# Altium schematic sheet etapa_1.SchDoc
size A4
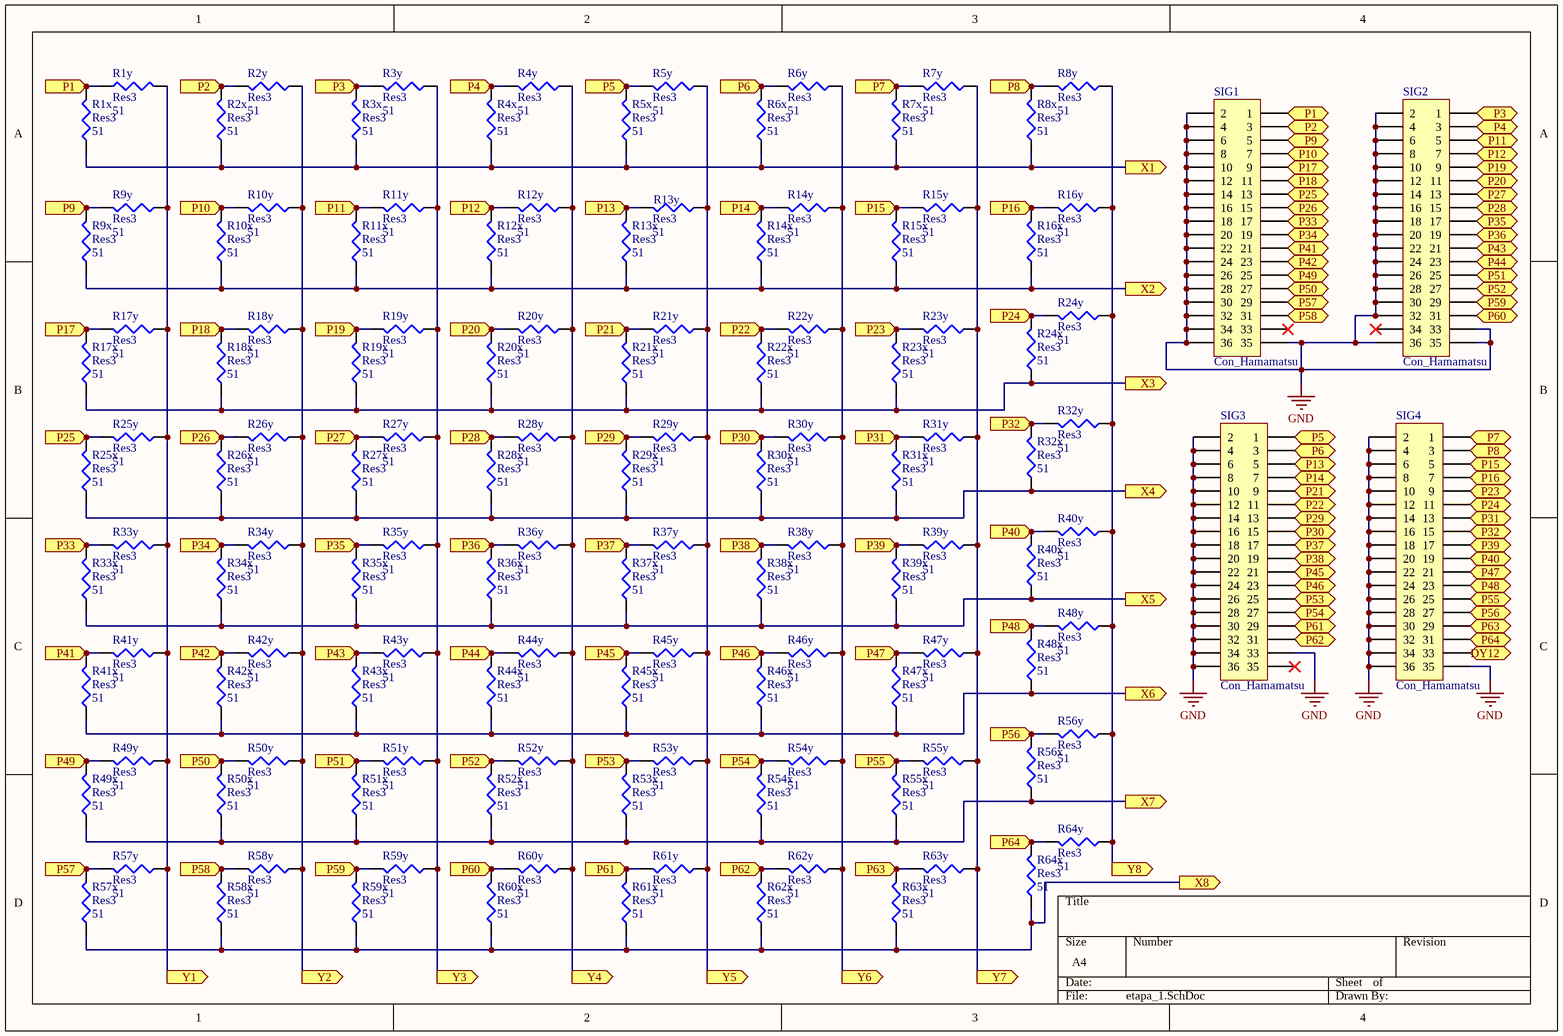
[diagram p0: etapa_1.SchDoc]

## Parts
R1x  Res3  value 51  [0402]
R1y  Res3  value 51  [0402]
R2x  Res3  value 51  [0402]
R2y  Res3  value 51  [0402]
R3x  Res3  value 51  [0402]
R3y  Res3  value 51  [0402]
R4x  Res3  value 51  [0402]
R4y  Res3  value 51  [0402]
R5x  Res3  value 51  [0402]
R5y  Res3  value 51  [0402]
R6x  Res3  value 51  [0402]
R6y  Res3  value 51  [0402]
R7x  Res3  value 51  [0402]
R7y  Res3  value 51  [0402]
R8x  Res3  value 51  [0402]
R8y  Res3  value 51  [0402]
R9x  Res3  value 51  [0402]
R9y  Res3  value 51  [0402]
R10x  Res3  value 51  [0402]
R10y  Res3  value 51  [0402]
R11x  Res3  value 51  [0402]
R11y  Res3  value 51  [0402]
R12x  Res3  value 51  [0402]
R12y  Res3  value 51  [0402]
R13x  Res3  value 51  [0402]
R13y  Res3  value 51  [0402]
R14x  Res3  value 51  [0402]
R14y  Res3  value 51  [0402]
R15x  Res3  value 51  [0402]
R15y  Res3  value 51  [0402]
R16x  Res3  value 51  [0402]
R16y  Res3  value 51  [0402]
R17x  Res3  value 51  [0402]
R17y  Res3  value 51  [0402]
R18x  Res3  value 51  [0402]
R18y  Res3  value 51  [0402]
R19x  Res3  value 51  [0402]
R19y  Res3  value 51  [0402]
R20x  Res3  value 51  [0402]
R20y  Res3  value 51  [0402]
R21x  Res3  value 51  [0402]
R21y  Res3  value 51  [0402]
R22x  Res3  value 51  [0402]
R22y  Res3  value 51  [0402]
R23x  Res3  value 51  [0402]
R23y  Res3  value 51  [0402]
R24x  Res3  value 51  [0402]
R24y  Res3  value 51  [0402]
R25x  Res3  value 51  [0402]
R25y  Res3  value 51  [0402]
R26x  Res3  value 51  [0402]
R26y  Res3  value 51  [0402]
R27x  Res3  value 51  [0402]
R27y  Res3  value 51  [0402]
R28x  Res3  value 51  [0402]
R28y  Res3  value 51  [0402]
R29x  Res3  value 51  [0402]
R29y  Res3  value 51  [0402]
R30x  Res3  value 51  [0402]
R30y  Res3  value 51  [0402]
R31x  Res3  value 51  [0402]
R31y  Res3  value 51  [0402]
R32x  Res3  value 51  [0402]
R32y  Res3  value 51  [0402]
R33x  Res3  value 51  [0402]
R33y  Res3  value 51  [0402]
R34x  Res3  value 51  [0402]
R34y  Res3  value 51  [0402]
R35x  Res3  value 51  [0402]
R35y  Res3  value 51  [0402]
R36x  Res3  value 51  [0402]
R36y  Res3  value 51  [0402]
R37x  Res3  value 51  [0402]
R37y  Res3  value 51  [0402]
R38x  Res3  value 51  [0402]
R38y  Res3  value 51  [0402]
R39x  Res3  value 51  [0402]
R39y  Res3  value 51  [0402]
R40x  Res3  value 51  [0402]
R40y  Res3  value 51  [0402]
R41x  Res3  value 51  [0402]
R41y  Res3  value 51  [0402]
R42x  Res3  value 51  [0402]
R42y  Res3  value 51  [0402]
R43x  Res3  value 51  [0402]
R43y  Res3  value 51  [0402]
R44x  Res3  value 51  [0402]
R44y  Res3  value 51  [0402]
R45x  Res3  value 51  [0402]
R45y  Res3  value 51  [0402]
R46x  Res3  value 51  [0402]
R46y  Res3  value 51  [0402]
R47x  Res3  value 51  [0402]
R47y  Res3  value 51  [0402]
R48x  Res3  value 51  [0402]
R48y  Res3  value 51  [0402]
R49x  Res3  value 51  [0402]
R49y  Res3  value 51  [0402]
R50x  Res3  value 51  [0402]
R50y  Res3  value 51  [0402]
R51x  Res3  value 51  [0402]
R51y  Res3  value 51  [0402]
R52x  Res3  value 51  [0402]
R52y  Res3  value 51  [0402]
R53x  Res3  value 51  [0402]
R53y  Res3  value 51  [0402]
R54x  Res3  value 51  [0402]
R54y  Res3  value 51  [0402]
R55x  Res3  value 51  [0402]
R55y  Res3  value 51  [0402]
R56x  Res3  value 51  [0402]
R56y  Res3  value 51  [0402]
R57x  Res3  value 51  [0402]
R57y  Res3  value 51  [0402]
R58x  Res3  value 51  [0402]
R58y  Res3  value 51  [0402]
R59x  Res3  value 51  [0402]
R59y  Res3  value 51  [0402]
R60x  Res3  value 51  [0402]
R60y  Res3  value 51  [0402]
R61x  Res3  value 51  [0402]
R61y  Res3  value 51  [0402]
R62x  Res3  value 51  [0402]
R62y  Res3  value 51  [0402]
R63x  Res3  value 51  [0402]
R63y  Res3  value 51  [0402]
R64x  Res3  value 51  [0402]
R64y  Res3  value 51  [0402]
SIG1  Con_Hamamatsu  [SQW-118-2]
SIG2  Con_Hamamatsu  [SQW-118-2]
SIG3  Con_Hamamatsu  [SQW-118-2]
SIG4  Con_Hamamatsu  [SQW-118-2]

## Ports
DY12 (out), P1 (in), P1 (out), P2 (in), P2 (out), P3 (in), P3 (out), P4 (in), P4 (out), P5 (in), P5 (out), P6 (in), P6 (out), P7 (in), P7 (out), P8 (in), P8 (out), P9 (in), P9 (out), P10 (in), P10 (out), P11 (in), P11 (out), P12 (in), P12 (out), P13 (in), P13 (out), P14 (in), P14 (out), P15 (in), P15 (out), P16 (in), P16 (out), P17 (in), P17 (out), P18 (in), P18 (out), P19 (in), P19 (out), P20 (in), P20 (out), P21 (in), P21 (out), P22 (in), P22 (out), P23 (in), P23 (out), P24 (in), P24 (out), P25 (in), P25 (out), P26 (in), P26 (out), P27 (in), P27 (out), P28 (in), P28 (out), P29 (in), P29 (out), P30 (in), P30 (out), P31 (in), P31 (out), P32 (in), P32 (out), P33 (in), P33 (out), P34 (in), P34 (out), P35 (in), P35 (out), P36 (in), P36 (out), P37 (in), P37 (out), P38 (in), P38 (out), P39 (in), P39 (out), P40 (in), P40 (out), P41 (in), P41 (out), P42 (in), P42 (out), P43 (in), P43 (out), P44 (in), P44 (out), P45 (in), P45 (out), P46 (in), P46 (out), P47 (in), P47 (out), P48 (in), P48 (out), P49 (in), P49 (out), P50 (in), P50 (out), P51 (in), P51 (out), P52 (in), P52 (out), P53 (in), P53 (out), P54 (in), P54 (out), P55 (in), P55 (out), P56 (in), P56 (out), P57 (in), P57 (out), P58 (in), P58 (out), P59 (in), P59 (out), P60 (in), P60 (out), P61 (in), P61 (out), P62 (in), P62 (out), P63 (in), P63 (out), P64 (in), P64 (out), X1 (out), X2 (out), X3 (out), X4 (out), X5 (out), X6 (out), X7 (out), X8 (out), Y1 (out), Y2 (out), Y3 (out), Y4 (out), Y5 (out), Y6 (out), Y7 (out), Y8 (out)

## Nets
GND: SIG1.2 SIG1.4 SIG1.6 SIG1.8 SIG1.10 SIG1.12 SIG1.14 SIG1.16 SIG1.18 SIG1.20 SIG1.22 SIG1.24 SIG1.26 SIG1.28 SIG1.30 SIG1.32 SIG1.34 SIG1.35 SIG1.36 SIG2.2 SIG2.4 SIG2.6 SIG2.8 SIG2.10 SIG2.12 SIG2.14 SIG2.16 SIG2.18 SIG2.20 SIG2.22 SIG2.24 SIG2.26 SIG2.28 SIG2.30 SIG2.32 SIG2.33 SIG2.35 SIG2.36 SIG3.2 SIG3.4 SIG3.6 SIG3.8 SIG3.10 SIG3.12 SIG3.14 SIG3.16 SIG3.18 SIG3.20 SIG3.22 SIG3.24 SIG3.26 SIG3.28 SIG3.30 SIG3.32 SIG3.33 SIG3.34 SIG3.36 SIG4.2 SIG4.4 SIG4.6 SIG4.8 SIG4.10 SIG4.12 SIG4.14 SIG4.16 SIG4.18 SIG4.20 SIG4.22 SIG4.24 SIG4.26 SIG4.28 SIG4.30 SIG4.32 SIG4.34 SIG4.35 SIG4.36
DY12: SIG4.33 ; port DY12
P1: R1x.2 R1y.1 SIG1.1 ; port P1
P2: R2x.2 R2y.2 SIG1.3 ; port P2
P3: R3x.2 R3y.2 SIG2.1 ; port P3
P4: R4x.2 R4y.2 SIG2.3 ; port P4
P5: R5x.2 R5y.2 SIG3.1 ; port P5
P6: R6x.2 R6y.2 SIG3.3 ; port P6
P7: R7x.2 R7y.2 SIG4.1 ; port P7
P8: R8x.2 R8y.2 SIG4.3 ; port P8
P9: R9x.2 R9y.2 SIG1.5 ; port P9
P10: R10x.2 R10y.2 SIG1.7 ; port P10
P11: R11x.2 R11y.2 SIG2.5 ; port P11
P12: R12x.2 R12y.2 SIG2.7 ; port P12
P13: R13x.2 R13y.2 SIG3.5 ; port P13
P14: R14x.2 R14y.2 SIG3.7 ; port P14
P15: R15x.2 R15y.2 SIG4.5 ; port P15
P16: R16x.2 R16y.2 SIG4.7 ; port P16
P17: R17x.2 R17y.2 SIG1.9 ; port P17
P18: R18x.2 R18y.2 SIG1.11 ; port P18
P19: R19x.2 R19y.2 SIG2.9 ; port P19
P20: R20x.2 R20y.2 SIG2.11 ; port P20
P21: R21x.2 R21y.2 SIG3.9 ; port P21
P22: R22x.2 R22y.2 SIG3.11 ; port P22
P23: R23x.2 R23y.2 SIG4.9 ; port P23
P24: R24x.2 R24y.2 SIG4.11 ; port P24
P25: R25x.2 R25y.2 SIG1.13 ; port P25
P26: R26x.2 R26y.2 SIG1.15 ; port P26
P27: R27x.2 R27y.2 SIG2.13 ; port P27
P28: R28x.2 R28y.2 SIG2.15 ; port P28
P29: R29x.2 R29y.2 SIG3.13 ; port P29
P30: R30x.2 R30y.2 SIG3.15 ; port P30
P31: R31x.2 R31y.2 SIG4.13 ; port P31
P32: R32x.2 R32y.2 SIG4.15 ; port P32
P33: R33x.2 R33y.2 SIG1.17 ; port P33
P34: R34x.2 R34y.2 SIG1.19 ; port P34
P35: R35x.2 R35y.2 SIG2.17 ; port P35
P36: R36x.2 R36y.2 SIG2.19 ; port P36
P37: R37x.2 R37y.2 SIG3.17 ; port P37
P38: R38x.2 R38y.2 SIG3.19 ; port P38
P39: R39x.2 R39y.2 SIG4.17 ; port P39
P40: R40x.2 R40y.2 SIG4.19 ; port P40
P41: R41x.2 R41y.2 SIG1.21 ; port P41
P42: R42x.2 R42y.2 SIG1.23 ; port P42
P43: R43x.2 R43y.2 SIG2.21 ; port P43
P44: R44x.2 R44y.2 SIG2.23 ; port P44
P45: R45x.2 R45y.2 SIG3.21 ; port P45
P46: R46x.2 R46y.2 SIG3.23 ; port P46
P47: R47x.2 R47y.2 SIG4.21 ; port P47
P48: R48x.2 R48y.2 SIG4.23 ; port P48
P49: R49x.2 R49y.2 SIG1.25 ; port P49
P50: R50x.2 R50y.2 SIG1.27 ; port P50
P51: R51x.2 R51y.2 SIG2.25 ; port P51
P52: R52x.2 R52y.2 SIG2.27 ; port P52
P53: R53x.2 R53y.2 SIG3.25 ; port P53
P54: R54x.2 R54y.2 SIG3.27 ; port P54
P55: R55x.2 R55y.2 SIG4.25 ; port P55
P56: R56x.2 R56y.2 SIG4.27 ; port P56
P57: R57x.2 R57y.2 SIG1.29 ; port P57
P58: R58x.2 R58y.2 SIG1.31 ; port P58
P59: R59x.2 R59y.2 SIG2.29 ; port P59
P60: R60x.2 R60y.2 SIG2.31 ; port P60
P61: R61x.2 R61y.2 SIG3.29 ; port P61
P62: R62x.2 R62y.2 SIG3.31 ; port P62
P63: R63x.2 R63y.2 SIG4.29 ; port P63
P64: R64x.2 R64y.2 SIG4.31 ; port P64
X1: R1x.1 R2x.1 R3x.1 R4x.1 R5x.1 R6x.1 R7x.1 R8x.1 ; port X1
X2: R9x.1 R10x.1 R11x.1 R12x.1 R13x.1 R14x.1 R15x.1 R16x.1 ; port X2
X3: R17x.1 R18x.1 R19x.1 R20x.1 R21x.1 R22x.1 R23x.1 R24x.1 ; port X3
X4: R25x.1 R26x.1 R27x.1 R28x.1 R29x.1 R30x.1 R31x.1 R32x.1 ; port X4
X5: R33x.1 R34x.1 R35x.1 R36x.1 R37x.1 R38x.1 R39x.1 R40x.1 ; port X5
X6: R41x.1 R42x.1 R43x.1 R44x.1 R45x.1 R46x.1 R47x.1 R48x.1 ; port X6
X7: R49x.1 R50x.1 R51x.1 R52x.1 R53x.1 R54x.1 R55x.1 R56x.1 ; port X7
X8: R57x.1 R58x.1 R59x.1 R60x.1 R61x.1 R62x.1 R63x.1 R64x.1 ; port X8
Y1: R1y.2 R9y.1 R17y.1 R25y.1 R33y.1 R41y.1 R49y.1 R57y.1 ; port Y1
Y2: R2y.1 R10y.1 R18y.1 R26y.1 R34y.1 R42y.1 R50y.1 R58y.1 ; port Y2
Y3: R3y.1 R11y.1 R19y.1 R27y.1 R35y.1 R43y.1 R51y.1 R59y.1 ; port Y3
Y4: R4y.1 R12y.1 R20y.1 R28y.1 R36y.1 R44y.1 R52y.1 R60y.1 ; port Y4
Y5: R5y.1 R13y.1 R21y.1 R29y.1 R37y.1 R45y.1 R53y.1 R61y.1 ; port Y5
Y6: R6y.1 R14y.1 R22y.1 R30y.1 R38y.1 R46y.1 R54y.1 R62y.1 ; port Y6
Y7: R7y.1 R15y.1 R23y.1 R31y.1 R39y.1 R47y.1 R55y.1 R63y.1 ; port Y7
Y8: R8y.1 R16y.1 R24y.1 R32y.1 R40y.1 R48y.1 R56y.1 R64y.1 ; port Y8

Not connected (* = marked no-connect by the designer): SIG1 33*; SIG2 34*; SIG3 35*

## Library data of the parts
R1x R1y R2x R2y R3x R3y R4x R4y R5x R5y R6x R6y R7x R7y R8x R8y R9x R9y R10x R10y R11x R11y R12x R12y R13x R13y R14x R14y R15x R15y R16x R16y R17x R17y R18x R18y R19x R19y R20x R20y R21x R21y R22x R22y R23x R23y R24x R24y R25x R25y R26x R26y R27x R27y R28x R28y R29x R29y R30x R30y R31x R31y R32x R32y R33x R33y R34x R34y R35x R35y R36x R36y R37x R37y R38x R38y R39x R39y R40x R40y R41x R41y R42x R42y R43x R43y R44x R44y R45x R45y R46x R46y R47x R47y R48x R48y R49x R49y R50x R50y R51x R51y R52x R52y R53x R53y R54x R54y R55x R55y R56x R56y R57x R57y R58x R58y R59x R59y R60x R60y R61x R61y R62x R62y R63x R63y R64x R64y = Res3: Resistor; Published: 8-Jun-2000; LatestRevisionDate: 29-May-2009; LatestRevisionNote: IPC-7351 Footprint Added.; PackageReference: J1-0603; Publisher: Altium Limited; PackageDescription: Chip Resistor